# EAGLE design 1906152158-Dev Board (EAGLE 9.4.0)
DRAFTER: David Antaki; REV: 1; STATUS: ISSUED FOR REVIEW

## Sheet 1 of 3
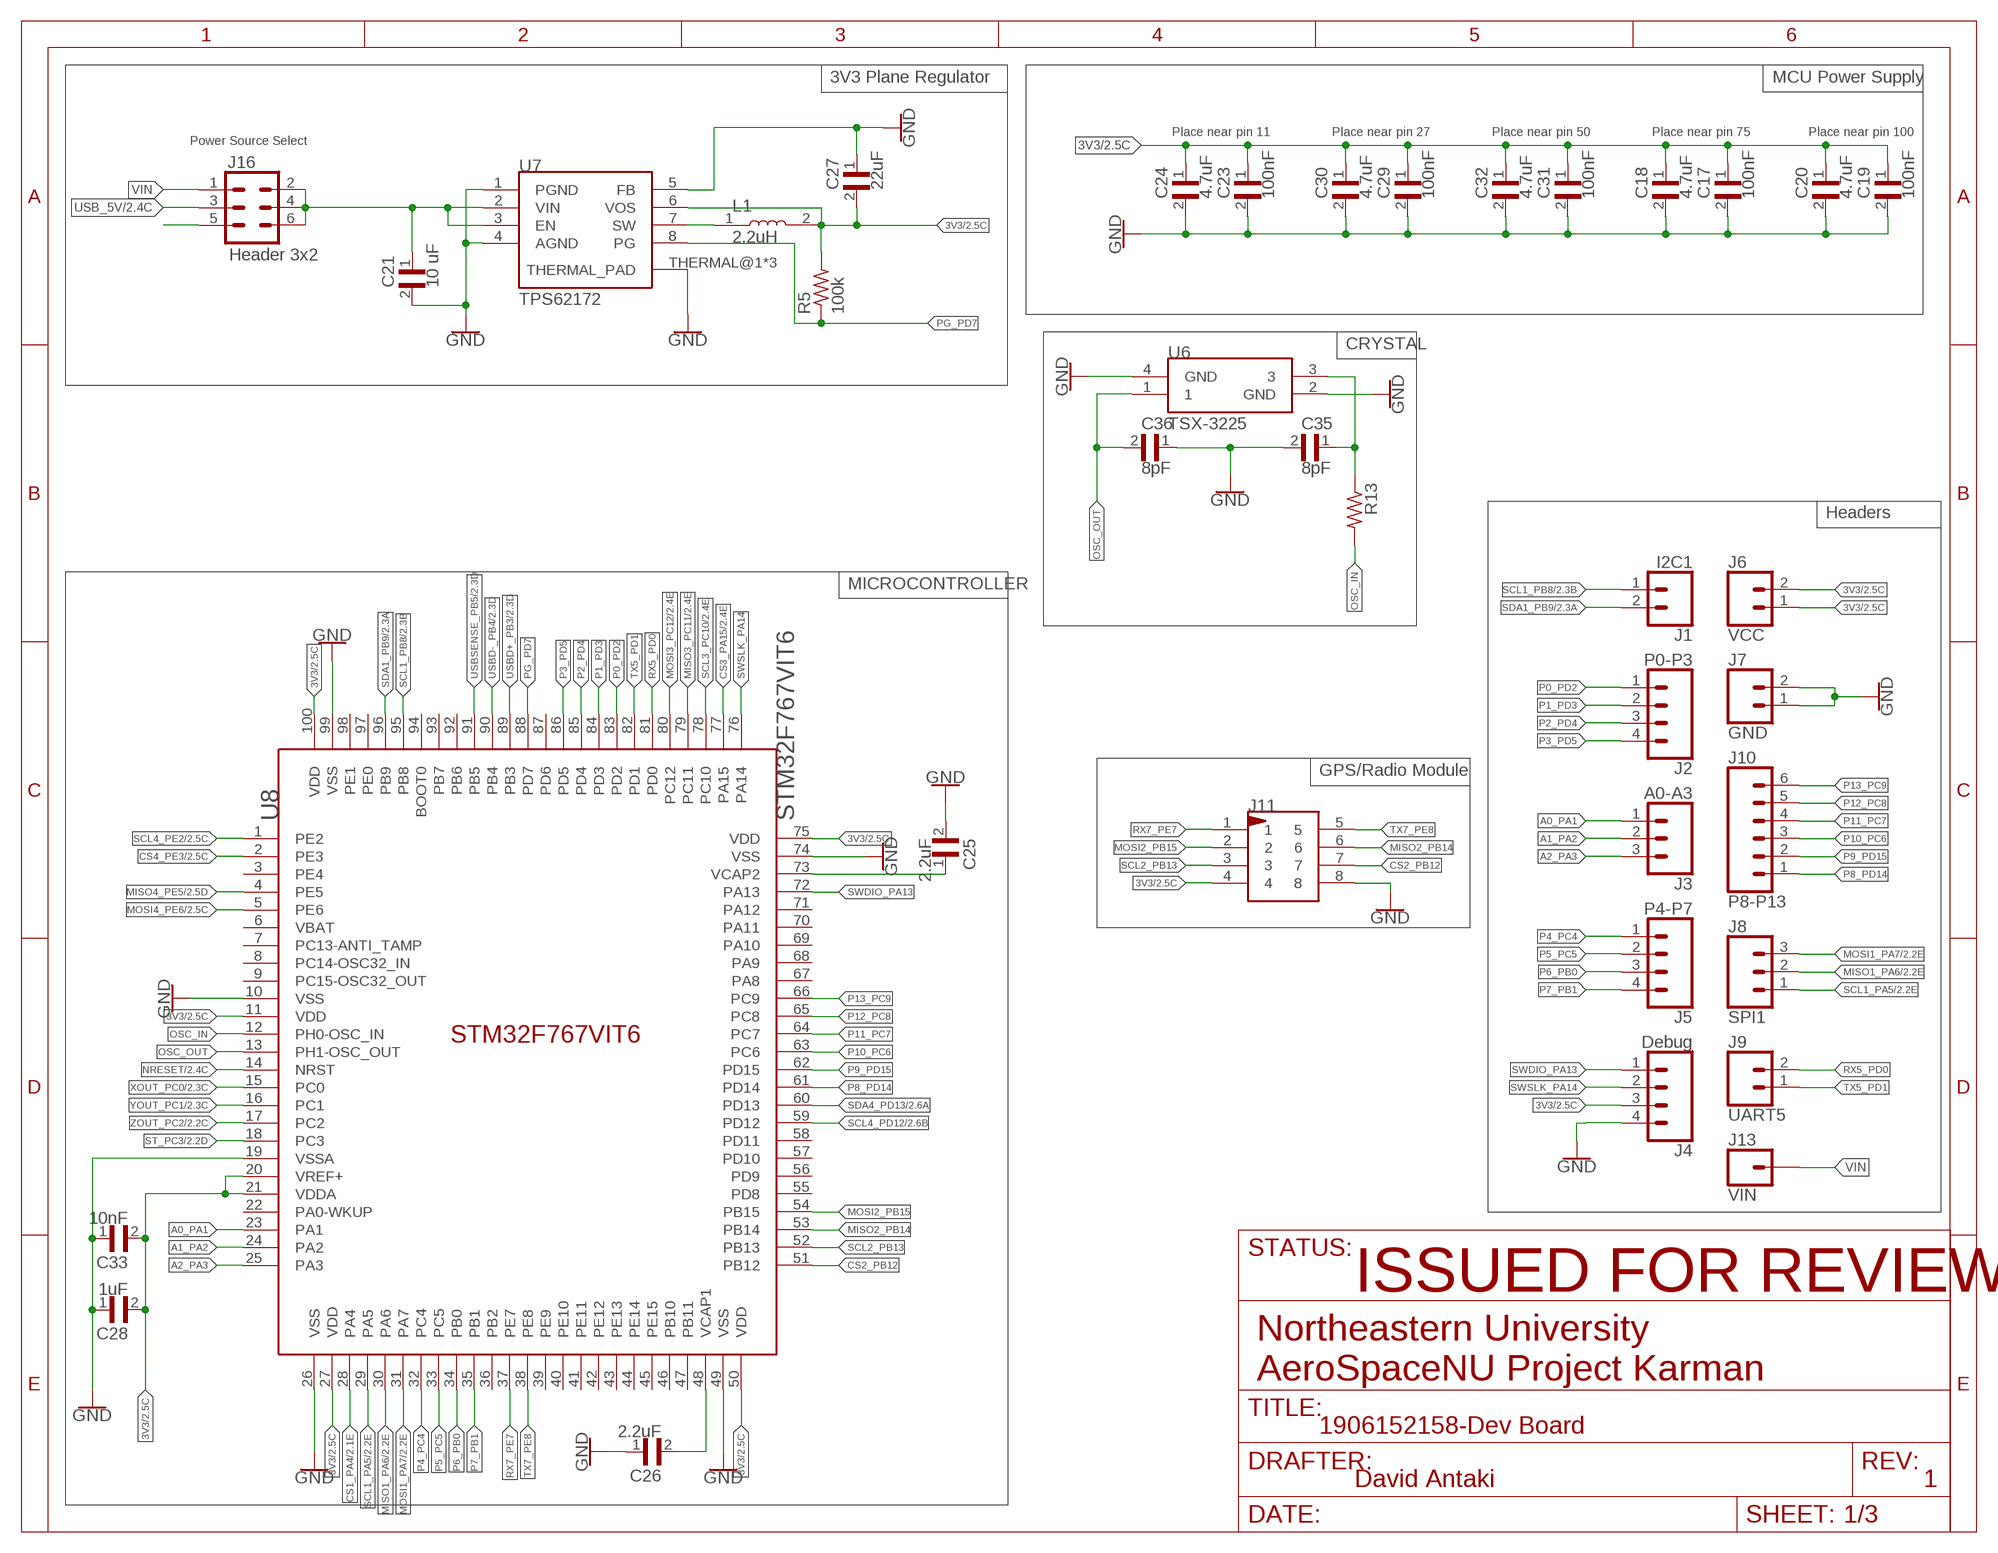
[diagram p0: schematic, sheet 1]

### Parts
C17  100nF  CGA3E2X7R1H104K080AD  [CAPC1608X95N]
C18  4.7uF  CGA3E2X7R1H104K080AD  [CAPC1608X95N]
C19  100nF  CGA3E2X7R1H104K080AD  [CAPC1608X95N]
C20  4.7uF  CGA3E2X7R1H104K080AD  [CAPC1608X95N]
C21  10 uF  CGA3E2X7R1H104K080AD  [CAPC1608X95N]
C23  100nF  CGA3E2X7R1H104K080AD  [CAPC1608X95N]
C24  4.7uF  CGA3E2X7R1H104K080AD  [CAPC1608X95N]
C25  2.2uF  CGA3E2X7R1H104K080AD  [CAPC1608X95N]
C26  2.2uF  CGA3E2X7R1H104K080AD  [CAPC1608X95N]
C27  22uF  CGA3E2X7R1H104K080AD  [CAPC1608X95N]
C28  1uF  CGA3E2X7R1H104K080AD  [CAPC1608X95N]
C29  100nF  CGA3E2X7R1H104K080AD  [CAPC1608X95N]
C30  4.7uF  CGA3E2X7R1H104K080AD  [CAPC1608X95N]
C31  100nF  CGA3E2X7R1H104K080AD  [CAPC1608X95N]
C32  4.7uF  CGA3E2X7R1H104K080AD  [CAPC1608X95N]
C33  10nF  CGA3E2X7R1H104K080AD  [CAPC1608X95N]
C35  8pF  CGA3E2X7R1H104K080AD  [CAPC1608X95N]
C36  8pF  CGA3E2X7R1H104K080AD  [CAPC1608X95N]
J1  I2C1  CONN_02  [1X02]
J2  P0-P3  CONN_04  [1X04]
J3  A0-A3  CONN_03  [1X03]
J4  Debug  CONN_04  [1X04]
J5  P4-P7  CONN_04  [1X04]
J6  VCC  CONN_02  [1X02]
J7  GND  CONN_02  [1X02]
J8  SPI1  CONN_03  [1X03]
J9  UART5  CONN_02  [1X02]
J10  P8-P13  CONN_06LOCK  [1X06_LOCK]
J11  087831-0819  [87831-0819]
J13  VIN  CONN_01  [1X01]
J16  Header 3x2  CONN_03X22X3_SILK_MALE_PTH  [2X3]
L1  2.2uH  MLF1608E100J  [INDC1608X95N]
R5  100k  CRGH0603F221K  [RESC1608X50N]
R13  CRGH0603F221K  [RESC1608X50N]
U6  TSX-3225  [TSX-3225]
U7  TPS62172  [TPS62172]
U8  STM32F767VIT6  [LQFP100_14X14]

### Nets
3V3: C17.1 C18.1 C19.1 C20.1 C23.1 C24.1 C27.2 C28.2 C29.1 C30.1 C31.1 C32.1 C33.2 J4.3 J6.1 J6.2 J11.4 L1.2 R5.2 U7.6(VOS) U8.11(VDD) U8.20(VREF+) U8.21(VDDA) U8.27(VDD) U8.50(VDD) U8.75(VDD) U8.100(VDD) ; also sheet 2
A0_PA1: J3.1 U8.23(PA1)
A1_PA2: J3.2 U8.24(PA2)
A2_PA3: J3.3 U8.25(PA3)
CS1_PA4: U8.28(PA4) ; also sheet 2
CS2_PB12: J11.7 U8.51(PB12)
CS3_PA15: U8.77(PA15) ; also sheet 2
CS4_PE3: U8.2(PE3) ; also sheet 2
GND: C17.2 C18.2 C19.2 C20.2 C21.2 C23.2 C24.2 C25.2 C26.1 C28.1 C29.2 C30.2 C31.2 C32.2 C33.1 C35.2 C36.1 J4.4 J7.1 J7.2 J11.8 U6.2(GND) U6.4(GND) U7.1(PGND) U7.4(AGND) U7.THERMAL@1(THERMAL_PAD) U7.THERMAL@2(THERMAL_PAD) U7.THERMAL@3(THERMAL_PAD) U8.10(VSS) U8.19(VSSA) U8.26(VSS) U8.49(VSS) U8.74(VSS) U8.99(VSS) ; also sheet 2
MISO1_PA6: J8.2 U8.30(PA6) ; also sheet 2
MISO2_PB14: J11.6 U8.53(PB14)
MISO3_PC11: U8.79(PC11) ; also sheet 2
MISO4_PE5: U8.4(PE5) ; also sheet 2
MOSI1_PA7: J8.3 U8.31(PA7) ; also sheet 2
MOSI2_PB15: J11.2 U8.54(PB15)
MOSI3_PC12: U8.80(PC12) ; also sheet 2
MOSI4_PE6: U8.5(PE6) ; also sheet 2
N$4: C25.1 U8.73(VCAP2)
N$7: C26.2 U8.48(VCAP1)
N$8: L1.1 U7.7(SW)
N$12: C27.1 U7.5(FB) ; supply symbol labelled GND
N$15: C35.1 R13.1 U6.3
N$17: J16.5
N$18: C21.1 J16.2 J16.4 J16.6 U7.2(VIN) U7.3(EN)
NRESET: U8.14(NRST) ; also sheet 2
OSC_IN: R13.2 U8.12(PH0-OSC_IN)
OSC_OUT: C36.2 U6.1 U8.13(PH1-OSC_OUT)
P0_PD2: J2.1 U8.83(PD2)
P1_PD3: J2.2 U8.84(PD3)
P2_PD4: J2.3 U8.85(PD4)
P3_PD5: J2.4 U8.86(PD5)
P4_PC4: J5.1 U8.32(PC4)
P5_PC5: J5.2 U8.33(PC5)
P6_PB0: J5.3 U8.34(PB0)
P7_PB1: J5.4 U8.35(PB1)
P8_PD14: J10.1 U8.61(PD14)
P9_PD15: J10.2 U8.62(PD15)
P10_PC6: J10.3 U8.63(PC6)
P11_PC7: J10.4 U8.64(PC7)
P12_PC8: J10.5 U8.65(PC8)
P13_PC9: J10.6 U8.66(PC9)
PG_PD7: R5.1 U7.8(PG) U8.88(PD7)
RX5_PD0: J9.2 U8.81(PD0)
RX7_PE7: J11.1 U8.37(PE7)
SCL1_PA5: J8.1 U8.29(PA5) ; also sheet 2
SCL1_PB8: J1.1 U8.95(PB8) ; also sheet 2
SCL2_PB13: J11.3 U8.52(PB13)
SCL3_PC10: U8.78(PC10) ; also sheet 2
SCL4_PD12: U8.59(PD12) ; also sheet 2
SCL4_PE2: U8.1(PE2) ; also sheet 2
SDA1_PB9: J1.2 U8.96(PB9) ; also sheet 2
SDA4_PD13: U8.60(PD13) ; also sheet 2
ST_PC3: U8.18(PC3) ; also sheet 2
SWDIO_PA13: J4.1 U8.72(PA13)
SWSLK_PA14: J4.2 U8.76(PA14)
TX5_PD1: J9.1 U8.82(PD1)
TX7_PE8: J11.5 U8.38(PE8)
USB_5V: J16.3 ; also sheet 2
USBD+_PB3: U8.89(PB3) ; also sheet 2
USBD-_PB4: U8.90(PB4) ; also sheet 2
USBSENSE_PB5: U8.91(PB5) ; also sheet 2
VIN: J13.1 J16.1
XOUT_PC0: U8.15(PC0) ; also sheet 2
YOUT_PC1: U8.16(PC1) ; also sheet 2
ZOUT_PC2: U8.17(PC2) ; also sheet 2
Unconnected: U8.3(PE4) U8.6(VBAT) U8.7(PC13-ANTI_TAMP) U8.8(PC14-OSC32_IN) U8.9(PC15-OSC32_OUT) U8.22(PA0-WKUP) U8.36(PB2) U8.39(PE9) U8.40(PE10) U8.41(PE11) U8.42(PE12) U8.43(PE13) U8.44(PE14) U8.45(PE15) U8.46(PB10) U8.47(PB11) U8.55(PD8) U8.56(PD9) U8.57(PD10) U8.58(PD11) U8.67(PA8) U8.68(PA9) U8.69(PA10) U8.70(PA11) U8.71(PA12) U8.87(PD6) U8.92(PB6) U8.93(PB7) U8.94(BOOT0) U8.97(PE0) U8.98(PE1)

### Notes on the sheet
- 3V3 Plane Regulator | MCU Power Supply
- Place near pin 11 | Place near pin 27 | Place near pin 50 | Place near pin 75 | Place near pin 100
- Power Source Select
- CRYSTAL
- Headers
- MICROCONTROLLER
- GPS/Radio Module

## Sheet 2 of 3
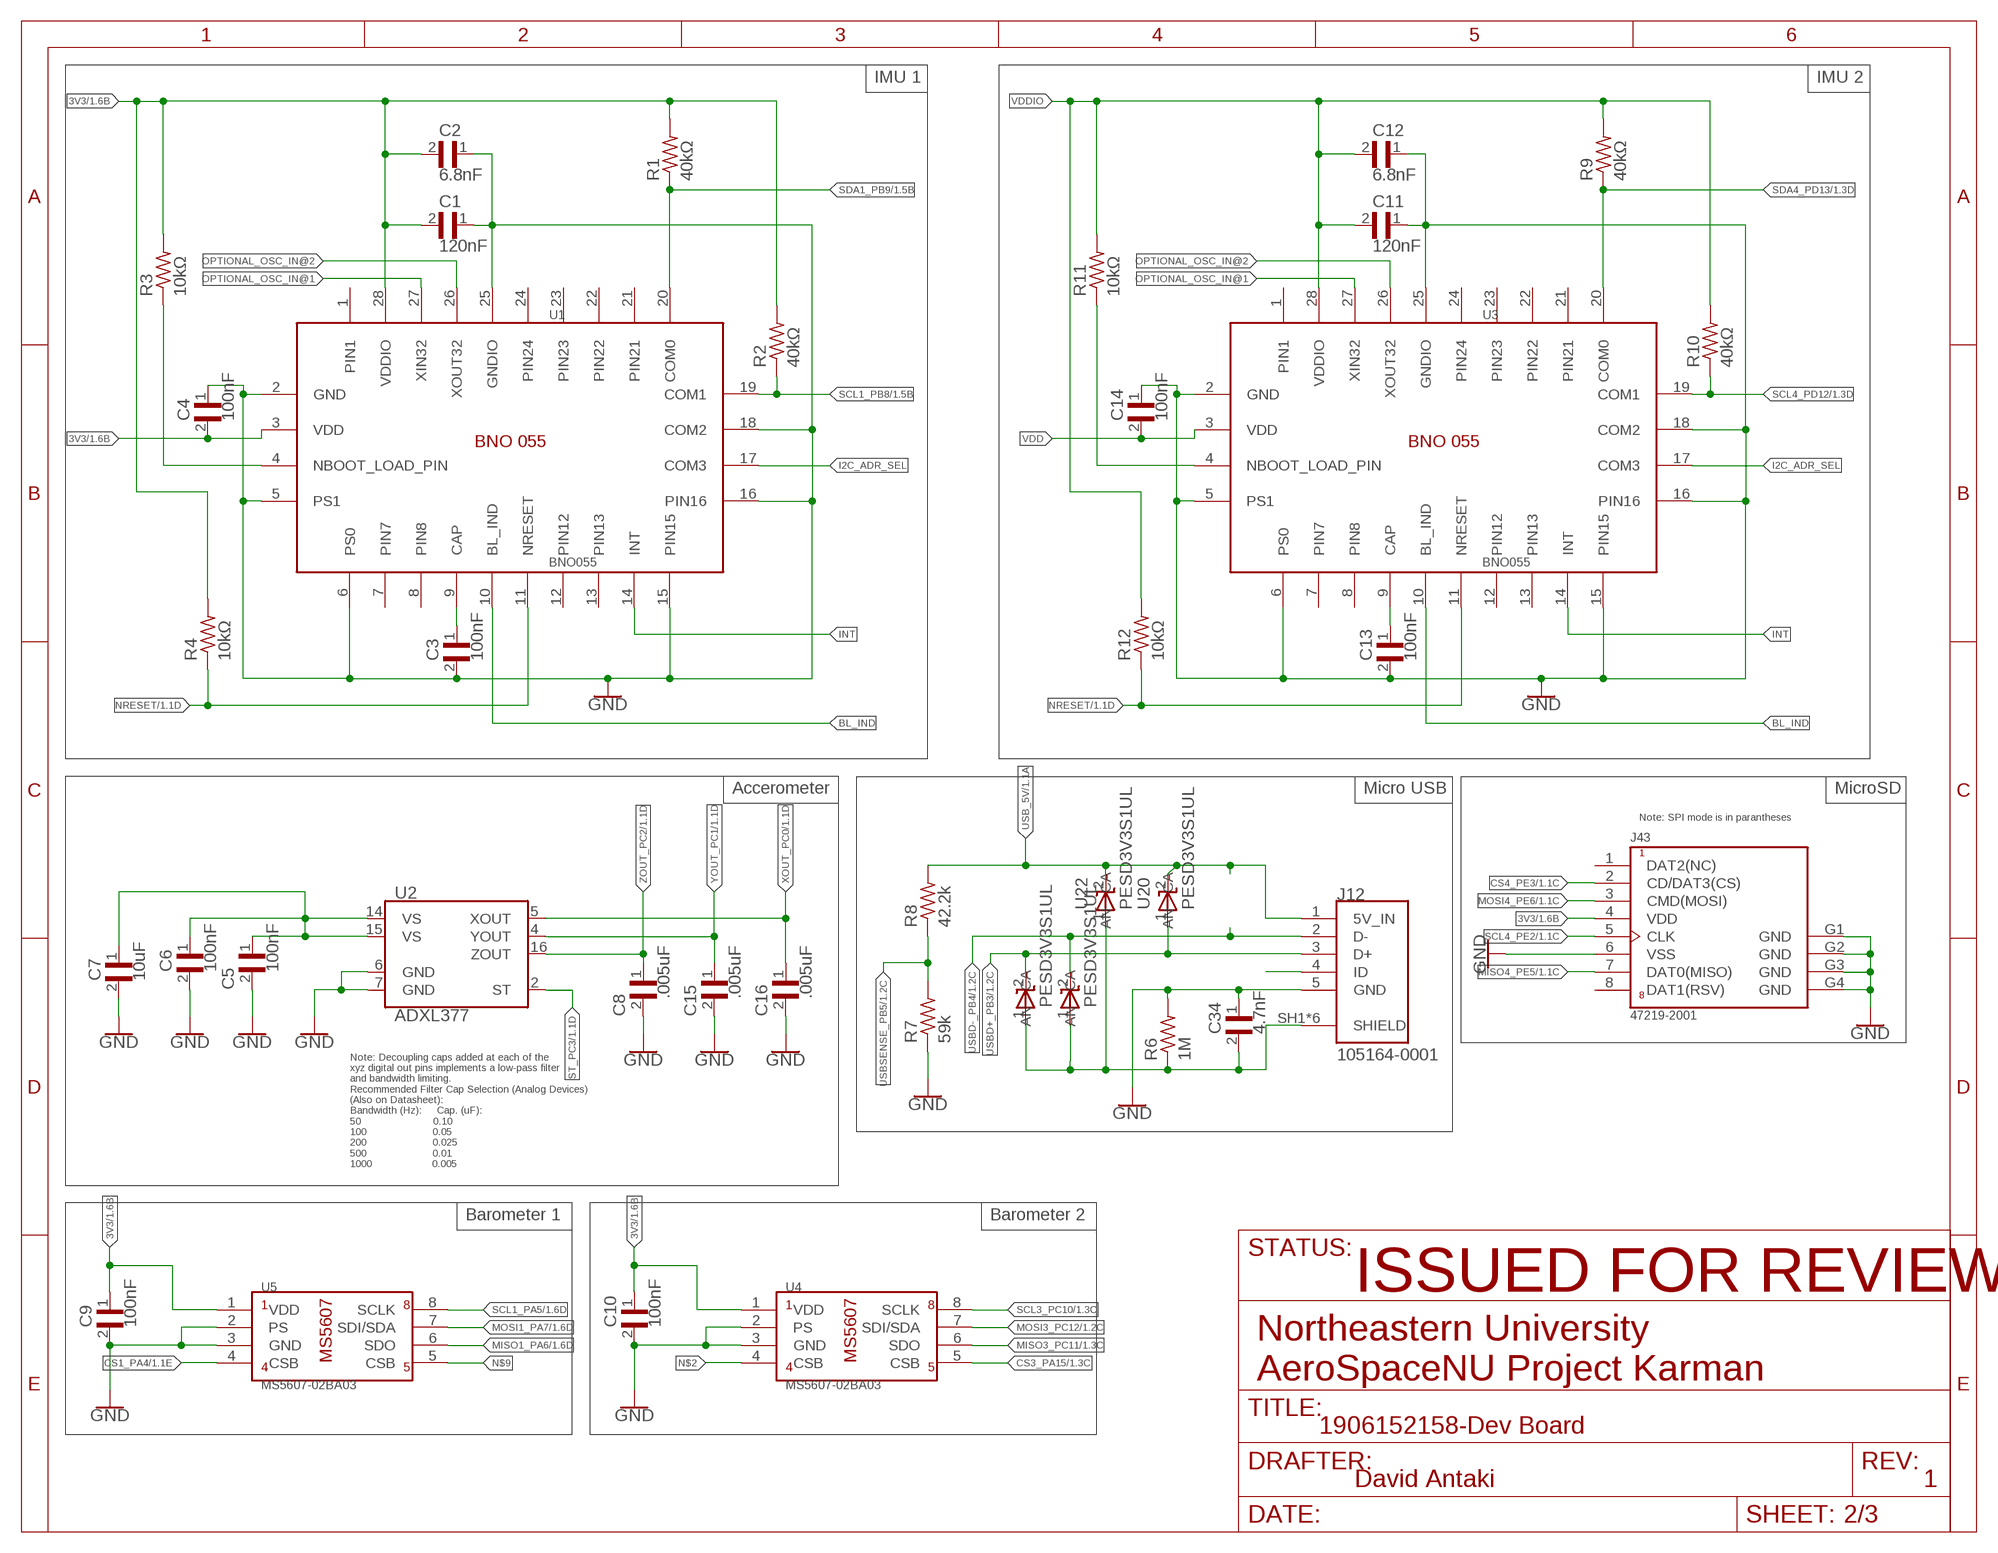
[diagram p1: schematic, sheet 2]

### Parts
C1  120nF  CGA3E2X7R1H104K080AD  [CAPC1608X95N]
C2  6.8nF  CGA3E2X7R1H104K080AD  [CAPC1608X95N]
C3  100nF  CGA3E2X7R1H104K080AD  [CAPC1608X95N]
C4  100nF  CGA3E2X7R1H104K080AD  [CAPC1608X95N]
C5  100nF  CGA3E2X7R1H104K080AD  [CAPC1608X95N]
C6  100nF  CGA3E2X7R1H104K080AD  [CAPC1608X95N]
C7  10uF  CGA3E2X7R1H104K080AD  [CAPC1608X95N]
C8  .005uF  CGA3E2X7R1H104K080AD  [CAPC1608X95N]
C9  100nF  CGA3E2X7R1H104K080AD  [CAPC1608X95N]
C10  100nF  CGA3E2X7R1H104K080AD  [CAPC1608X95N]
C11  120nF  CGA3E2X7R1H104K080AD  [CAPC1608X95N]
C12  6.8nF  CGA3E2X7R1H104K080AD  [CAPC1608X95N]
C13  100nF  CGA3E2X7R1H104K080AD  [CAPC1608X95N]
C14  100nF  CGA3E2X7R1H104K080AD  [CAPC1608X95N]
C15  .005uF  CGA3E2X7R1H104K080AD  [CAPC1608X95N]
C16  .005uF  CGA3E2X7R1H104K080AD  [CAPC1608X95N]
C34  4.7nF  CGA3E2X7R1H104K080AD  [CAPC1608X95N]
J12  105164-0001  [MOLEX_105164-0001]
J43  47219-2001  [MOLEX_47219-2001]
R1  40kΩ  CRGH0603F221K  [RESC1608X50N]
R2  40kΩ  CRGH0603F221K  [RESC1608X50N]
R3  10kΩ  CRGH0603F221K  [RESC1608X50N]
R4  10kΩ  CRGH0603F221K  [RESC1608X50N]
R6  1M  CRGH0603F221K  [RESC1608X50N]
R7  59k  CRGH0603F221K  [RESC1608X50N]
R8  42.2k  CRGH0603F221K  [RESC1608X50N]
R9  40kΩ  CRGH0603F221K  [RESC1608X50N]
R10  40kΩ  CRGH0603F221K  [RESC1608X50N]
R11  10kΩ  CRGH0603F221K  [RESC1608X50N]
R12  10kΩ  CRGH0603F221K  [RESC1608X50N]
U1  BNO055  [LGA28R50P4X10_380X520X100]
U2  ADXL377  [LFCSP-16-3X3]
U3  BNO055  [LGA28R50P4X10_380X520X100]
U4  MS5607-02BA03  [TE_MS860702BA01-50]
U5  MS5607-02BA03  [TE_MS860702BA01-50]
U20  PESD3V3S1UL  [SOD882]
U22  PESD3V3S1UL  [SOD882]
U23  PESD3V3S1UL  [SOD882]
U24  PESD3V3S1UL  [SOD882]

### Nets
3V3: C1.2 C2.2 C4.2 C9.1 C10.1 J43.4(VDD) R1.2 R2.2 R3.2 R4.2 U1.3(VDD) U1.28(VDDIO) U4.1(VDD) U5.1(VDD) ; also sheet 1
BL_IND: U1.10(BL_IND) U3.10(BL_IND)
CS1_PA4: U5.4(CSB) ; also sheet 1
CS3_PA15: U4.5(CSB) ; also sheet 1
CS4_PE3: J43.2(CD/DAT3(CS)) ; also sheet 1
GND: C1.1 C2.1 C3.2 C4.1 C5.2 C6.2 C7.2 C8.2 C9.2 C10.2 C11.1 C12.1 C13.2 C14.1 C15.2 C16.2 C34.1 J12.5(GND) J43.6(VSS) J43.G1(GND) J43.G2(GND) J43.G3(GND) J43.G4(GND) R6.2 R7.1 U1.2(GND) U1.5(PS1) U1.6(PS0) U1.15(PIN15) U1.16(PIN16) U1.18(COM2) U1.25(GNDIO) U2.6(GND) U2.7(GND) U3.2(GND) U3.5(PS1) U3.6(PS0) U3.15(PIN15) U3.16(PIN16) U3.18(COM2) U3.25(GNDIO) U4.2(PS) U4.3(GND) U5.2(PS) U5.3(GND) ; also sheet 1
I2C_ADR_SEL: U1.17(COM3) U3.17(COM3)
INT: U1.14(INT) U3.14(INT)
MISO1_PA6: U5.6(SDO) ; also sheet 1
MISO3_PC11: U4.6(SDO) ; also sheet 1
MISO4_PE5: J43.7(DAT0(MISO)) ; also sheet 1
MOSI1_PA7: U5.7(SDI/SDA) ; also sheet 1
MOSI3_PC12: U4.7(SDI/SDA) ; also sheet 1
MOSI4_PE6: J43.3(CMD(MOSI)) ; also sheet 1
N$1: C3.1 U1.9(CAP)
N$2: U4.4(CSB)
N$3: R3.1 U1.4(NBOOT_LOAD_PIN)
N$5: C13.1 U3.9(CAP)
N$6: R11.1 U3.4(NBOOT_LOAD_PIN)
N$9: U5.5(CSB)
N$11: C5.1 C6.1 C7.1 U2.14(VS) U2.15(VS)
N$13: J12.4(ID)
N$14: C34.2 J12.SH1(SHIELD) J12.SH2(SHIELD) J12.SH3(SHIELD) J12.SH4(SHIELD) J12.SH5(SHIELD) J12.SH6(SHIELD) R6.1 U22.1(CA) U23.1(CA) U24.1(CA)
NRESET: R4.1 R12.1 U1.11(NRESET) U3.11(NRESET) ; also sheet 1
OPTIONAL_OSC_IN@1: U1.27(XIN32) U3.27(XIN32)
OPTIONAL_OSC_IN@2: U1.26(XOUT32) U3.26(XOUT32)
SCL1_PA5: U5.8(SCLK) ; also sheet 1
SCL1_PB8: R2.1 U1.19(COM1) ; also sheet 1
SCL3_PC10: U4.8(SCLK) ; also sheet 1
SCL4_PD12: R10.1 U3.19(COM1) ; also sheet 1
SCL4_PE2: J43.5(CLK) ; also sheet 1
SDA1_PB9: R1.1 U1.20(COM0) ; also sheet 1
SDA4_PD13: R9.1 U3.20(COM0) ; also sheet 1
ST_PC3: U2.2(ST) ; also sheet 1
USB_5V: J12.1(5V_IN) R8.2 U20.2(AN) U22.2(AN) ; also sheet 1
USBD+_PB3: J12.3(D+) U20.1(CA) U24.2(AN) ; also sheet 1
USBD-_PB4: J12.2(D-) U23.2(AN) ; also sheet 1
USBSENSE_PB5: R7.2 R8.1 ; also sheet 1
VDD: C14.2 U3.3(VDD)
VDDIO: C11.2 C12.2 R9.2 R10.2 R11.2 R12.2 U3.28(VDDIO)
XOUT_PC0: C16.1 U2.5(XOUT) ; also sheet 1
YOUT_PC1: C15.1 U2.4(YOUT) ; also sheet 1
ZOUT_PC2: C8.1 U2.16(ZOUT) ; also sheet 1
Unconnected: J43.1(DAT2(NC)) J43.8(DAT1(RSV)) U1.1(PIN1) U1.12(PIN12) U1.13(PIN13) U3.1(PIN1) U3.12(PIN12) U3.13(PIN13)

### Notes on the sheet
- IMU 1 | IMU 2
- Accerometer | Micro USB | MicroSD
- Note: Decoupling caps added at each of the
  xyz digital out pins implements a low-pass filter
  and bandwidth limiting.
  Recommended Filter Cap Selection (Analog Devices)
  (Also on Datasheet):
  Bandwidth (Hz):     Cap. (uF):
  50                        0.10
  100                      0.05
  200                      0.025
  500                      0.01
  1000                    0.005
- Barometer 1 | Barometer 2

## Sheet 3 of 3
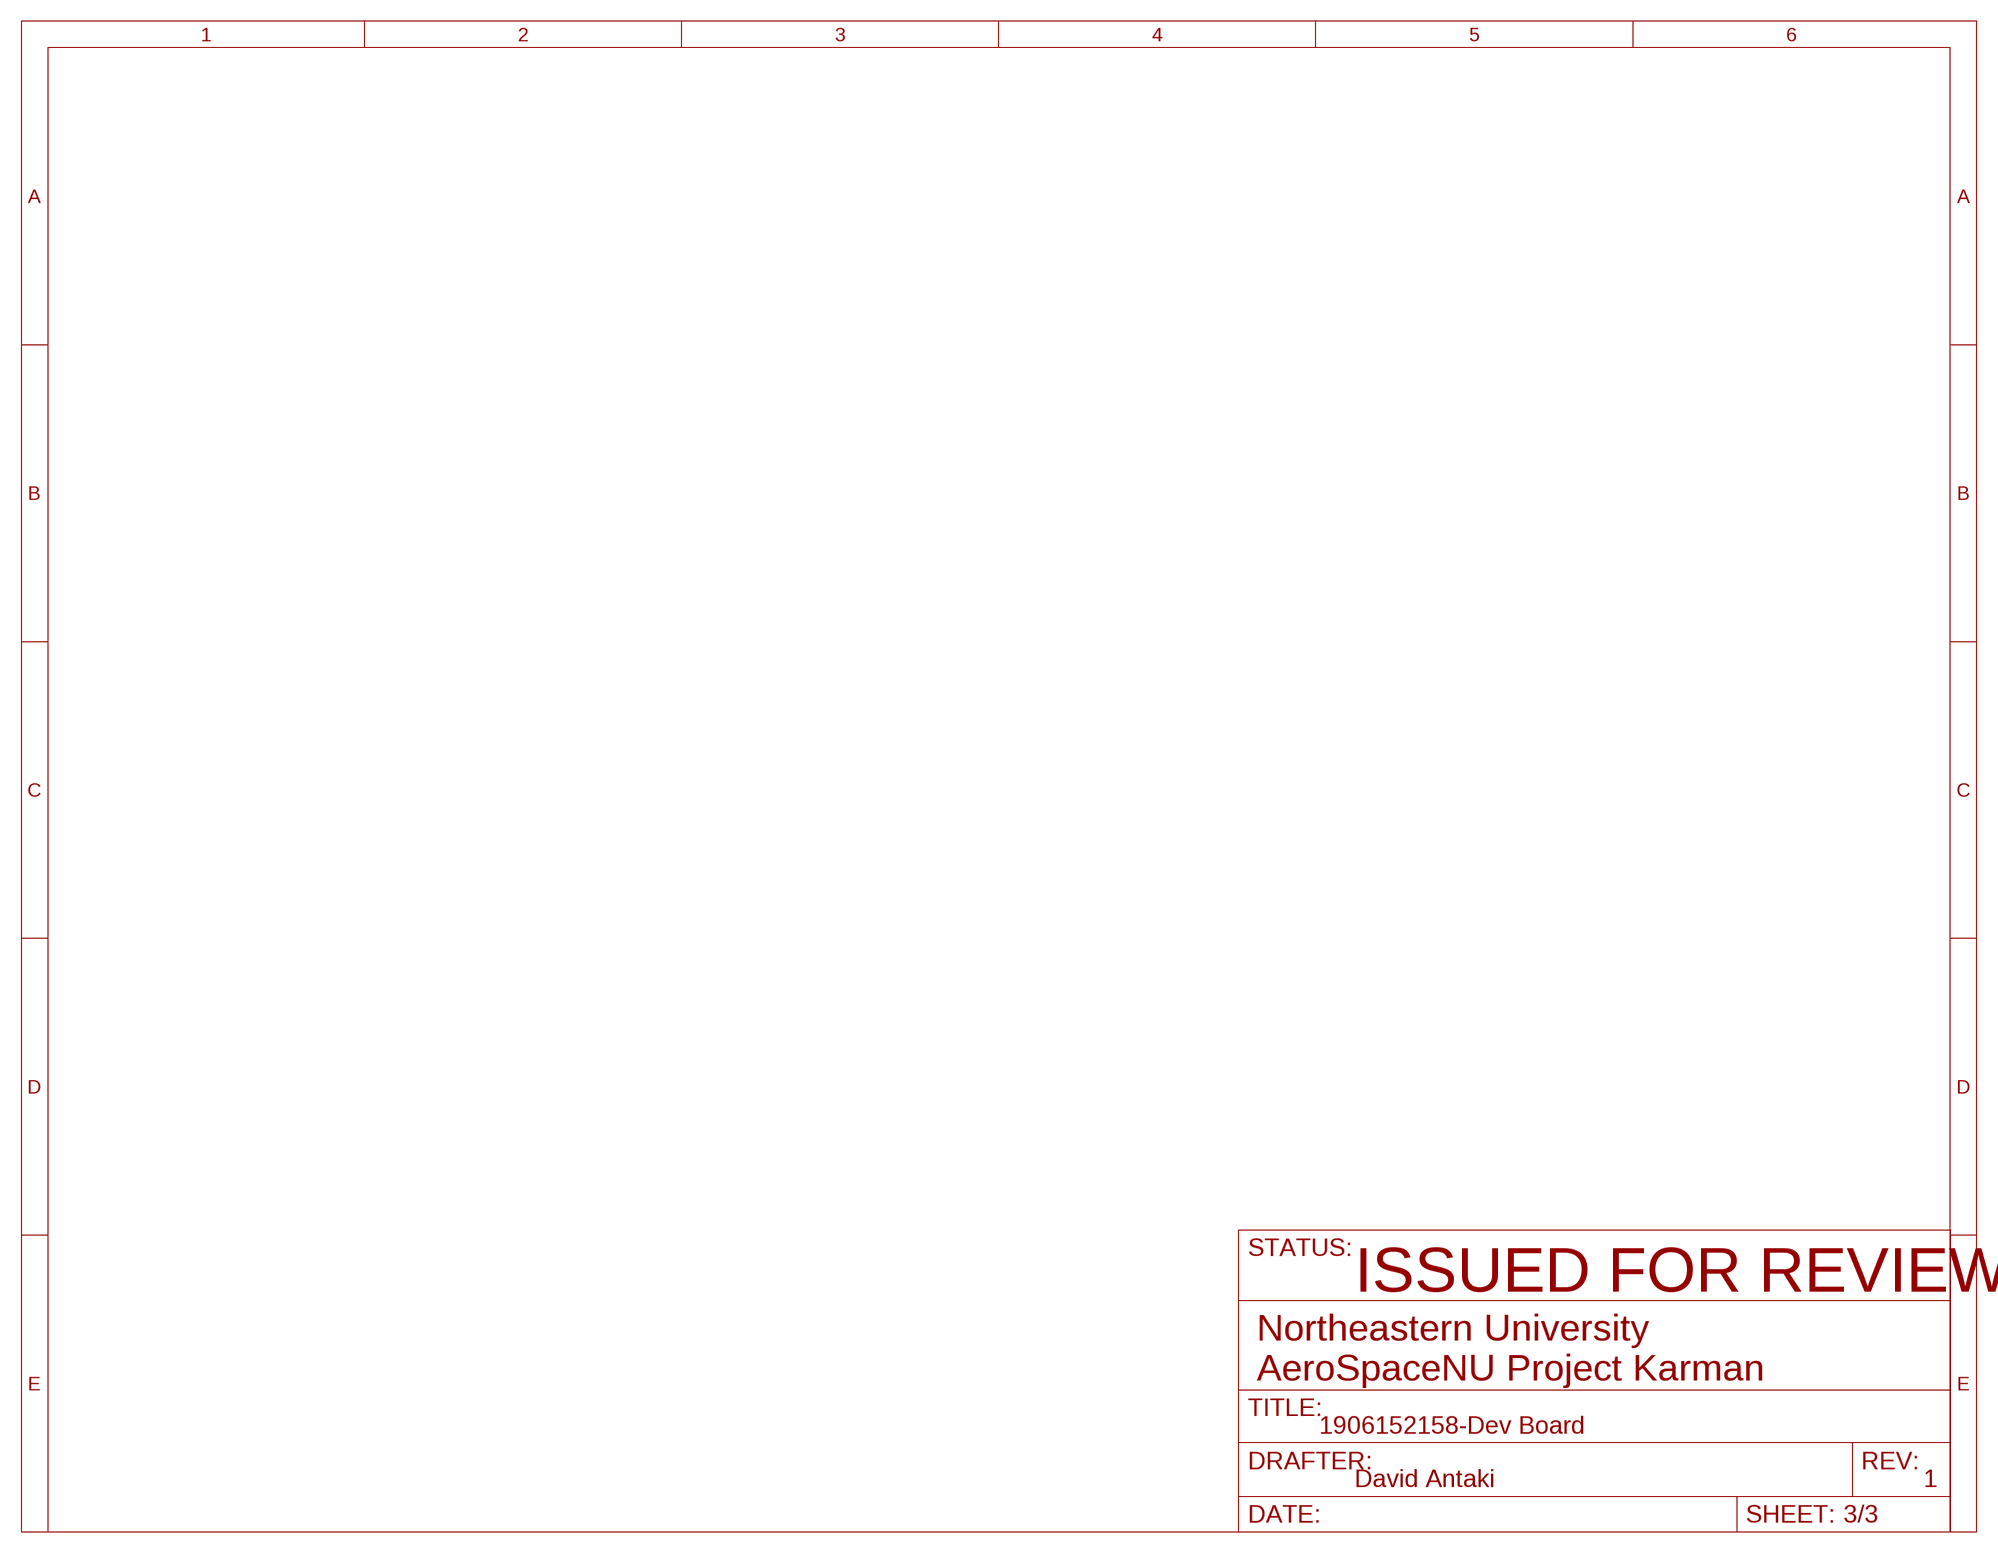
[diagram p2: schematic, sheet 3]

## Power pins joined to a net without a drawn wire
PIN7: U1.7(PIN7) U3.7(PIN7)
PIN8: U1.8(PIN8) U3.8(PIN8)
PIN21: U1.21(PIN21) U3.21(PIN21)
PIN22: U1.22(PIN22) U3.22(PIN22)
PIN23: U1.23(PIN23) U3.23(PIN23)
PIN24: U1.24(PIN24) U3.24(PIN24)

## Library data of the parts
C1-C21 C23-C36 = CGA3E2X7R1H104K080AD:CGA3E2X7R1H104K080AD: CGA Series 0603 0.1 uF 50 V ±10% X7R SMT Multilayer Ceramic Capacitor; AVAILABILITY: Unavailable; DESCRIPTION: CGA Series 0603 0.1 uF 50 V ±10% X7R SMT Multilayer Ceramic Capacitor; MF: TDK; MP: CGA3E2X7R1H104K080AD; PACKAGE: 0603 TDK; PRICE: None
J1 J6 J7 J9 = SparkFun-Connectors:CONN_02: Multi connection point. Often used as Generic Header-pin footprint for 0.1 inch spaced/style header connections On any of the 0.1 inch spaced packages, you can populate with these: Break Away Headers - Straight <https://www.sparkfun.com/products/116> (PRT-00116) Break Away Male Headers - Right Angle <https://www.sparkfun.com/products/553> (PRT-00553) Female Headers <https://www.sparkfun.com/products/115> (PRT-00115) Break Away Headers - Machine Pin <https://www.sparkfun.com/products/117> (PRT-00117) Break Away Female Headers - Swiss Machine Pin <https://www.sparkfun.com/products/743> (PRT-00743) For SCREWTERMINALS and SPRING TERMINALS visit here: Screw Terimnals on SparkFun.com <https://www.sparkfun.com/search/results?term=Screw+Terminals> (5mm/3.5mm/2.54mm spacing) This device is also useful as a general connection point to wire up your design to another part of your project. Our various solder wires solder well into these plated through hole pads. Hook-Up Wire - Assortment (Stranded, 22 AWG) <https://www.sparkfun.com/products/11375> (PRT-11375) Hook-Up Wire - Assortment (Solid Core, 22 AWG) <https://www.sparkfun.com/products/11367> (PRT-11367) View the entire wire category on our website here <https://www.sparkfun.com/categories/141> Special notes: Molex polarized connector foot print use with: PRT-08233 with associated crimp pins and housings. 2.54_SCREWTERM for use with PRT-10571. 3.5mm Screw Terminal footprints for PRT-08084 5mm Screw Terminal footprints for use with PRT-08432
J2 J4 J5 = SparkFun-Connectors:CONN_04: Multi connection point. Often used as Generic Header-pin footprint for 0.1 inch spaced/style header connections On any of the 0.1 inch spaced packages, you can populate with these: Break Away Headers - Straight <https://www.sparkfun.com/products/116> (PRT-00116) Break Away Male Headers - Right Angle <https://www.sparkfun.com/products/553> (PRT-00553) Female Headers <https://www.sparkfun.com/products/115> (PRT-00115) Break Away Headers - Machine Pin <https://www.sparkfun.com/products/117> (PRT-00117) Break Away Female Headers - Swiss Machine Pin <https://www.sparkfun.com/products/743> (PRT-00743) For SCREWTERMINALS and SPRING TERMINALS visit here: Screw Terimnals on SparkFun.com <https://www.sparkfun.com/search/results?term=Screw+Terminals> (5mm/3.5mm/2.54mm spacing) This device is also useful as a general connection point to wire up your design to another part of your project. Our various solder wires solder well into these plated through hole pads. Hook-Up Wire - Assortment (Stranded, 22 AWG) <https://www.sparkfun.com/products/11375> (PRT-11375) Hook-Up Wire - Assortment (Solid Core, 22 AWG) <https://www.sparkfun.com/products/11367> (PRT-11367) View the entire wire category on our website here <https://www.sparkfun.com/categories/141> Special notes: Molex polarized connector foot print use with SKU : PRT-08231 with associated crimp pins and housings. 1MM SMD Version SKU: PRT-10208; PROD_ID: CONN-09696
J3 J8 = SparkFun-Connectors:CONN_03: Multi connection point. Often used as Generic Header-pin footprint for 0.1 inch spaced/style header connections On any of the 0.1 inch spaced packages, you can populate with these: Break Away Headers - Straight <https://www.sparkfun.com/products/116> (PRT-00116) Break Away Male Headers - Right Angle <https://www.sparkfun.com/products/553> (PRT-00553) Female Headers <https://www.sparkfun.com/products/115> (PRT-00115) Break Away Headers - Machine Pin <https://www.sparkfun.com/products/117> (PRT-00117) Break Away Female Headers - Swiss Machine Pin <https://www.sparkfun.com/products/743> (PRT-00743) Stackable Header - 3 Pin (Female, 0.1") <https://www.sparkfun.com/products/13875> (PRT-13875) For SCREWTERMINALS and SPRING TERMINALS visit here: Screw Terimnals on SparkFun.com <https://www.sparkfun.com/search/results?term=Screw+Terminals> (5mm/3.5mm/2.54mm spacing) This device is also useful as a general connection point to wire up your design to another part of your project. Our various solder wires solder well into these plated through hole pads. Hook-Up Wire - Assortment (Stranded, 22 AWG) <https://www.sparkfun.com/products/11375> (PRT-11375) Hook-Up Wire - Assortment (Solid Core, 22 AWG) <https://www.sparkfun.com/products/11367> (PRT-11367) View the entire wire category on our website here <https://www.sparkfun.com/categories/141> Special notes: Molex polarized connector foot print use with SKU : PRT-08232 with associated crimp pins and housings.
J10 = SparkFun-Connectors:CONN_06: Multi connection point. Often used as Generic Header-pin footprint for 0.1 inch spaced/style header connections On any of the 0.1 inch spaced packages, you can populate with these: Break Away Headers - Straight <https://www.sparkfun.com/products/116> (PRT-00116) Break Away Male Headers - Right Angle <https://www.sparkfun.com/products/553> (PRT-00553) Female Headers <https://www.sparkfun.com/products/115> (PRT-00115) Break Away Headers - Machine Pin <https://www.sparkfun.com/products/117> (PRT-00117) Break Away Female Headers - Swiss Machine Pin <https://www.sparkfun.com/products/743> (PRT-00743) Arduino Stackable Header - 6 Pin <https://www.sparkfun.com/products/9280> (PRT-09280) For SCREWTERMINALS and SPRING TERMINALS visit here: Screw Terimnals on SparkFun.com <https://www.sparkfun.com/search/results?term=Screw+Terminals> (5mm/3.5mm/2.54mm spacing) This device is also useful as a general connection point to wire up your design to another part of your project. Our various solder wires solder well into these plated through hole pads. Hook-Up Wire - Assortment (Stranded, 22 AWG) <https://www.sparkfun.com/products/11375> (PRT-11375) Hook-Up Wire - Assortment (Solid Core, 22 AWG) <https://www.sparkfun.com/products/11367> (PRT-11367) View the entire wire category on our website here <https://www.sparkfun.com/categories/141>
J11 = Molex:087831-0819
J12 = 105164-0001:105164-0001: Micro-USB B Receptacle without Flange, Top Mount, Surface Mount, Lead-Free; AVAILABILITY: Unavailable; DESCRIPTION: Micro-USB B Receptacle without Flange, Top Mount, Surface Mount, Lead-Free; MF: Molex; MP: 105164-0001; PACKAGE: None; PRICE: None
J13 = SparkFun-Connectors:CONN_01: Single connection point. Often used as Generic Header-pin footprint for 0.1 inch spaced/style header connections On any of the 0.1 inch spaced packages, you can populate with these: Break Away Headers - Straight <https://www.sparkfun.com/products/116> (PRT-00116) Break Away Male Headers - Right Angle <https://www.sparkfun.com/products/553> (PRT-00553) Female Headers <https://www.sparkfun.com/products/115> (PRT-00115) Break Away Headers - Machine Pin <https://www.sparkfun.com/products/117> (PRT-00117) Break Away Female Headers - Swiss Machine Pin <https://www.sparkfun.com/products/743> (PRT-00743) This device is also useful as a general connection point to wire up your design to another part of your project. Our various solder wires solder well into these plated through hole pads. Hook-Up Wire - Assortment (Stranded, 22 AWG) <https://www.sparkfun.com/products/11375> (PRT-11375) Hook-Up Wire - Assortment (Solid Core, 22 AWG) <https://www.sparkfun.com/products/11367> (PRT-11367) View the entire wire category on our website here <https://www.sparkfun.com/categories/141> Special notes: SMTSO-256-ET is a "flush mount" nut for a 4-40 screw. We mostly use this on specialty testbeds; it is a nice way to connect hardware to your PCB at an adjustable hieght. Also note, the SNAP packages are for using a snappable style connector. We sell a baggie of snaps and they are also used on two LilyPad designs: Snap Assortment - 30 pack (male and female) <https://www.sparkfun.com/products/11347> (DEV-11347) LilyPad Arduino SimpleSnap <https://www.sparkfun.com/products/10941> (DEV-10941) LilyPad SimpleSnap Protoboard <https://www.sparkfun.com/products/10940> (DEV-10940)
J16 = SparkFun-Connectors:CONN_03X2: Multi connection point. Often used as Generic Header-pin footprint for 0.1 inch spaced/style header connections You can populate with any combo of single row headers, but if you'd like an exact match, check these: Header - 2x3 (Male, 0.1") <https://www.sparkfun.com/products/12807> (PRT-12807) Header - 2x3 (Female, 0.1") <https://www.sparkfun.com/products/13010> (PRT-13010) 2x3 Pin Shrouded Header <https://www.sparkfun.com/products/10877> (PRT-10877) On any of the 0.1 inch spaced packages, you can populate with these: Break Away Headers - Straight <https://www.sparkfun.com/products/116> (PRT-00116) Break Away Male Headers - Right Angle <https://www.sparkfun.com/products/553> (PRT-00553) Female Headers <https://www.sparkfun.com/products/115> (PRT-00115) Break Away Headers - Machine Pin <https://www.sparkfun.com/products/117> (PRT-00117) Break Away Female Headers - Swiss Machine Pin <https://www.sparkfun.com/products/743> (PRT-00743) Special note: the shrouded connector mates well with our 3x2 ribbon cables: Ribbon Crimp Connector - 6-pin (2x3, Female) <https://www.sparkfun.com/products/10651> (PRT-10651) Ribbon Cable - 6 wire (15ft) <https://www.sparkfun.com/products/10646> (PRT-10646); PROD_ID: CONN-09701
J43 = 47219-2001:47219-2001: 1.10mm Pitch microSD Card Connector, Hinge Type, Lead-Free http://www.snapeda.com/parts/47219-2001/Molex%20/%20Waldom/view-part/#; AVAILABILITY: Unavailable; DESCRIPTION: Conn Micro SD Card SKT 8 POS 1.1mm Solder RA SMD 0.5A/Contact Embossed T/R; MF: Molex; MP: 47219-2001; PACKAGE: None; PRICE: None
L1 = 0603_Inductor:MLF1608E100J: Ind Shielded Multi-Layer 10uH 5% 2MHz 30Q-Factor Ferrite 10mA 0603; AVAILABILITY: Unavailable; DESCRIPTION: Inductor RF Chip Shielded Multi-Layer 10uH 5% 2MHz 30Q-Factor Ferrite 10mA 1.7Ohm DCR 0603 T/R; MF: TDK; MP: MLF1608E100J; PACKAGE: 0603 TDK; PRICE: None
R1-R4 R9-R12 = CRGH0603F221K:CRGH0603F221K: Res Thick Film 0603 221K Ohm 1% 1/5W ±100ppm/°C Molded SMD SMD T/R; AVAILABILITY: Unavailable; COMMENT: 2-1879507-2; DESCRIPTION: Res Thick Film 0603 221K Ohm 1% 1/5W ±100ppm/°C Molded SMD SMD T/R; MF: TE Connectivity; MP: CRGH0603F221K; PACKAGE: 0603 TE Connectivity; PRICE: None; TE_PURCHASE_URL: https://www.te.com/usa-en/product-2-1879507-2.html?te_bu=Cor&te_type=disp&te_campaign=seda_glo_cor-seda-global-disp-prtnr-fy19-seda-model-bom-cta_sma-317_1&elqCampaignId=32493
R5-R8 R13 = 0603_Resistor:CRGH0603F221K: Res Thick Film 0603 221K Ohm 1% 1/5W ±100ppm/°C Molded SMD SMD T/R; AVAILABILITY: Unavailable; COMMENT: 2-1879507-2; DESCRIPTION: Res Thick Film 0603 221K Ohm 1% 1/5W ±100ppm/°C Molded SMD SMD T/R; MF: TE Connectivity; MP: CRGH0603F221K; PACKAGE: 0603 TE Connectivity; PRICE: None; TE_PURCHASE_URL: https://www.te.com/usa-en/product-2-1879507-2.html?te_bu=Cor&te_type=disp&te_campaign=seda_glo_cor-seda-global-disp-prtnr-fy19-seda-model-bom-cta_sma-317_1&elqCampaignId=32493
U1 U3 = BNO055:BNO055: BNO055 9-axis Absolute Orientation Sensor ( SiP ) w/Sensors and Sensor Fusion; AVAILABILITY: Unavailable; DESCRIPTION: BNO055 9-axis Absolute Orientation Sensor _ SiP _ w/Sensors and Sensor Fusion; MF: Bosch; MP: BNO055; PACKAGE: LGA-28 Bosch; PRICE: None
U2 = ADXL377:ADXL377: Analog Devices ADXL377 Low Power 3-Axis ±200 g Accelerometer with Analog Output The ADXL377 is a small, thin, low power, complete 3-axis accelerometer with signal conditioned voltage outputs. The ADXL377 measures acceleration resulting from motion, shock, or vibration with a typical full-scale range of ±200g. Datasheet <https://cdn.sparkfun.com/datasheets/Sensors/Accelerometers/ADXL377.pdf> SparkFun Products SparkFun Triple Axis Accelerometer Breakout - ADXL377 <https://www.sparkfun.com/products/12803> (SEN-12803); AVAILABILITY: Unavailable; DESCRIPTION: ADI Small, Low Power, 3-Axis +/-3g3x3x1.45mm; MF: Analog Devices; MP: ADXL377; PACKAGE: None; PRICE: None
U4 U5 = MS5607-02BA03:MS5607-02BA03
U6 = TSX-3225 16.0000MF09Z-AC0:TSX-3225
U7 = TPS62172:TPS62172
U8 = STM32F767VIT6:STM32F767VIT6
U20 U22-U24 = PESD3V3S1UL:PESD3V3S1UL: PESD3V3S1UL Zener Diode Made by David Antaki Digikey <https://www.digikey.com/product-detail/en/nexperia-usa-inc/PESD3V3S1UL315/1727-5353-1-ND/2676832> Datasheet <https://assets.nexperia.com/documents/data-sheet/PESDXS1UL_SER.pdf>

## Board
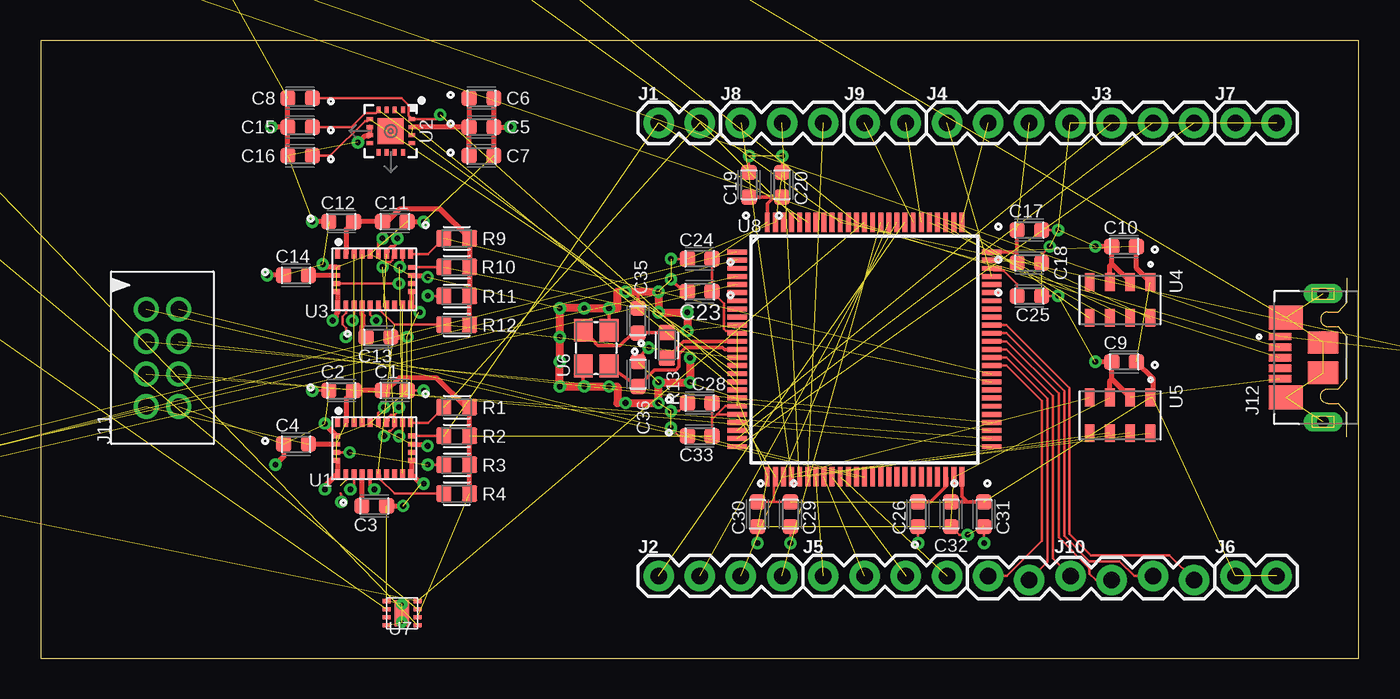
[diagram p3: board, top side]
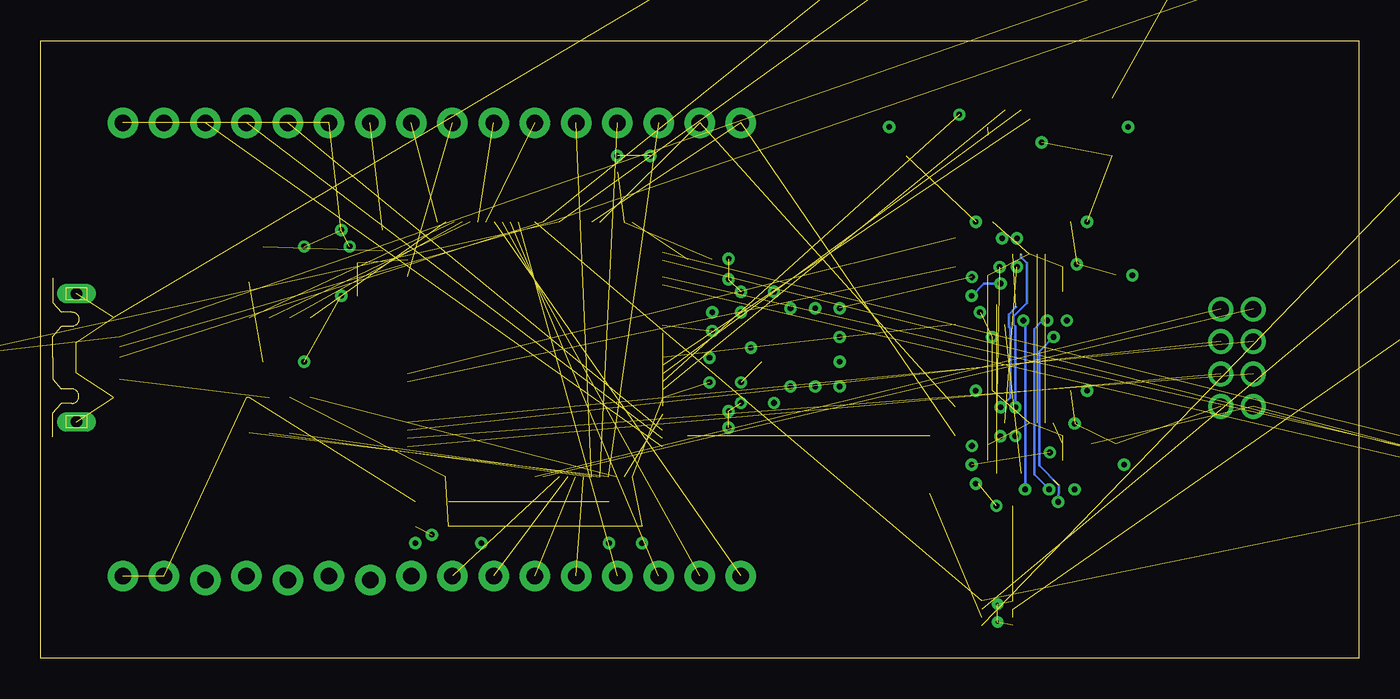
[diagram p4: board, bottom side, seen from below]

Size 81.28 x 38.1 mm. Coordinates in mm from the lower left corner, seen from the top.
Outline: 0,0 81.28,0 81.28,38.1 0,38.1 0,0
Copper layers (1*16): Top 0.035mm / dielectric 1.5mm / Bottom 0.035mm
Design rules "default": minimum track width 6mil, minimum drill 0.35mm, track to track 6mil, track to pad 6mil, pad to pad 6mil, via to via 6mil, smd to smd 6mil, copper to edge 40mil, drill to drill 6mil, minimum pad ring 10mil, minimum via ring 8mil, stop-mask expansion 4mil, vias tented up to drill 0mil, thermal gap 10mil

### Footprints (pad centres in the part's own frame; a part is rotated, then mirrored left to right if it is on the bottom)
CAPC1608X95N = smd 0.95 x 0.97: 1 -0.76,0; 2 0.76,0
1X02 = drill 1.016 pad 1.88: 1 0,0; 2 2.54,0
1X04 = drill 1.016 pad 1.88: 1 0,0; 2 2.54,0; 3 5.08,0; 4 7.62,0
1X03 = drill 1.016 pad 1.88: 1 0,0; 2 2.54,0; 3 5.08,0
1X06_LOCK = drill 1.016 pad 1.88: 1 0,0; 2 2.54,-0.254; 3 5.08,0; 4 7.62,-0.254; 5 10.16,0; 6 12.7,-0.254
87831-0819 = drill 1.016: 1 8.325,4.15; 2 6.325,4.15; 3 4.325,4.15; 4 2.325,4.15; 5 8.325,2.15; 6 6.325,2.15; 7 4.325,2.15; 8 2.325,2.15
MOLEX_105164-0001 = smd 0.45 x 1.38: 1 1.3,4.11; 2 0.65,4.11; 3 0,4.11; 4 -0.65,4.11; 5 -1.3,4.11 | drill 0.7 long: SH1 -3.95,1.45; SH6 3.95,1.45 | smd 1.475 x 2.1: SH2 -2.462,3.75; SH5 2.462,3.75 | smd 1.375 x 1.9: SH3 -0.938,1.45; SH4 0.938,1.45
1X01 = drill 1.016 pad 1.88: 1 0,0
2X3 = drill 1.016 pad 1.88: 1 0,0; 2 0,2.54; 3 2.54,0; 4 2.54,2.54; 5 5.08,0; 6 5.08,2.54
MOLEX_47219-2001 = smd 0.8 x 1.5: 1 3.2,-2.1; 2 2.1,-2.1; 3 1,-2.1; 4 -0.1,-2.1; 5 -1.2,-2.1; 6 -2.3,-2.1; 7 -3.4,-2.1; 8 -4.5,-2.1 | smd 1.5 x 2.05: G1 6.875,-4.7; G2 6.875,3.6; G3 -6.875,3.6; G4 -6.875,-4.7
INDC1608X95N = smd 0.9 x 0.97: 1 -0.785,0; 2 0.785,0
RESC1608X50N = smd 0.94 x 1.02: 1 -0.79,0; 2 0.79,0
LGA28R50P4X10_380X520X100 = smd 0.3 x 0.525: 1 -2.25,1.562; 6 -2.25,-1.562; 7 -1.75,-1.562; 8 -1.25,-1.562; 9 -0.75,-1.562; 10 -0.25,-1.562; 11 0.25,-1.562; 12 0.75,-1.562; 13 1.25,-1.562; 14 1.75,-1.562; 15 2.25,-1.562; 20 2.25,1.562; 21 1.75,1.562; 22 1.25,1.562; 23 0.75,1.562; 24 0.25,1.562; 25 -0.25,1.562; 26 -0.75,1.562; 27 -1.25,1.562; 28 -1.75,1.562 | smd 0.425 x 0.3: 2 -2.312,0.75; 3 -2.312,0.25; 4 -2.312,-0.25; 5 -2.312,-0.75; 16 2.312,-0.75; 17 2.312,-0.25; 18 2.312,0.25; 19 2.312,0.75
LFCSP-16-3X3 = smd 0.4 x 0.25: 1 -1.3,0.75; 2 -1.3,0.25; 3 -1.3,-0.25; 4 -1.3,-0.75; 9 1.3,-0.75; 10 1.3,-0.25; 11 1.3,0.25; 12 1.3,0.75 | smd 0.25 x 0.4: 5 -0.75,-1.3; 6 -0.25,-1.3; 7 0.25,-1.3; 8 0.75,-1.3; 13 0.75,1.3; 14 0.25,1.3; 15 -0.25,1.3; 16 -0.75,1.3 | smd 1.6 x 1.6: EXP 0,0
TE_MS860702BA01-50 = smd 1.1 x 0.6: 1 -1.1,1.875; 2 -1.1,0.625; 3 -1.1,-0.625; 4 -1.1,-1.875; 5 1.1,-1.875; 6 1.1,-0.625; 7 1.1,0.625; 8 1.1,1.875
TSX-3225 = smd 1.4 x 1.15: 1 0,0; 2 2.2,0; 3 2.2,1.6; 4 0,1.6
TPS62172 = smd 0.5 x 0.25: 1 -0.01,1.5; 2 -0.01,1; 3 -0.01,0.5; 4 -0.01,0; 5 1.9,0; 6 1.9,0.5; 7 1.9,1; 8 1.9,1.5 | smd 0.9 x 1.6: THERMAL@1 0.95,0.75 | drill 0.2 pad 0.254: THERMAL@2 0.95,1.3; THERMAL@3 0.95,0.2
LQFP100_14X14 = smd 1.2 x 0.3: 1 -7.85,6; 2 -7.85,5.5; 3 -7.85,5; 4 -7.85,4.5; 5 -7.85,4; 6 -7.85,3.5; 7 -7.85,3; 8 -7.85,2.5; 9 -7.85,2; 10 -7.85,1.5; 11 -7.85,1; 12 -7.85,0.5; 13 -7.85,0; 14 -7.85,-0.5; 15 -7.85,-1; 16 -7.85,-1.5; 17 -7.85,-2; 18 -7.85,-2.5; 19 -7.85,-3; 20 -7.85,-3.5; 21 -7.85,-4; 22 -7.85,-4.5; 23 -7.85,-5; 24 -7.85,-5.5; 25 -7.85,-6; 51 7.85,-6; 52 7.85,-5.5; 53 7.85,-5; 54 7.85,-4.5; 55 7.85,-4; 56 7.85,-3.5; 57 7.85,-3; 58 7.85,-2.5; 59 7.85,-2; 60 7.85,-1.5; 61 7.85,-1; 62 7.85,-0.5; 63 7.85,0; 64 7.85,0.5; 65 7.85,1; 66 7.85,1.5; 67 7.85,2; 68 7.85,2.5; 69 7.85,3; 70 7.85,3.5; 71 7.85,4; 72 7.85,4.5; 73 7.85,5; 74 7.85,5.5; 75 7.85,6 | smd 0.3 x 1.2: 26 -6,-7.85; 27 -5.5,-7.85; 28 -5,-7.85; 29 -4.5,-7.85; 30 -4,-7.85; 31 -3.5,-7.85; 32 -3,-7.85; 33 -2.5,-7.85; 34 -2,-7.85; 35 -1.5,-7.85; 36 -1,-7.85; 37 -0.5,-7.85; 38 0,-7.85; 39 0.5,-7.85; 40 1,-7.85; 41 1.5,-7.85; 42 2,-7.85; 43 2.5,-7.85; 44 3,-7.85; 45 3.5,-7.85; 46 4,-7.85; 47 4.5,-7.85; 48 5,-7.85; 49 5.5,-7.85; 50 6,-7.85; 76 6,7.85; 77 5.5,7.85; 78 5,7.85; 79 4.5,7.85; 80 4,7.85; 81 3.5,7.85; 82 3,7.85; 83 2.5,7.85; 84 2,7.85; 85 1.5,7.85; 86 1,7.85; 87 0.5,7.85; 88 0,7.85; 89 -0.5,7.85; 90 -1,7.85; 91 -1.5,7.85; 92 -2,7.85; 93 -2.5,7.85; 94 -3,7.85; 95 -3.5,7.85; 96 -4,7.85; 97 -4.5,7.85; 98 -5,7.85; 99 -5.5,7.85; 100 -6,7.85
SOD882 = smd 0.4 x 0.7: 1 -0.35,0; 2 0.35,0

### Placement (x,y rotation side)
C1  21.84,16.51 180 top
C2  18.54,16.51 0 top
C3  20.57,9.4 0 top
C4  15.75,13.21 0 top
C5  27.18,32.77 0 top
C6  27.18,34.54 0 top
C7  27.18,30.99 0 top
C8  16,34.54 180 top
C9  66.8,18.29 180 top
C10  66.8,25.4 180 top
C11  21.84,26.92 180 top
C12  18.54,26.92 0 top
C13  20.83,19.81 0 top
C14  15.75,23.62 0 top
C15  16,32.77 180 top
C16  16,30.99 180 top
C17  60.96,26.42 0 top
C18  60.96,24.38 0 top
C19  43.69,29.21 90 top
C20  45.72,29.21 90 top
C21  -48.26,52.07 0 top  (outside the outline)
C23  40.64,22.61 180 top
C24  40.64,24.64 180 top
C25  60.96,22.35 0 top
C26  54.1,8.89 90 top
C27  -29.21,57.15 0 top  (outside the outline)
C28  40.64,15.75 0 top
C29  46.23,8.89 270 top
C30  44.2,8.89 270 top
C31  58.17,8.89 270 top
C32  56.13,8.89 270 top
C33  40.64,13.72 0 top
C34  -21.59,57.15 0 top  (outside the outline)
C35  36.83,20.83 90 top
C36  36.83,17.53 270 top
J1  38.1,33.02 0 top
J2  38.1,5.08 0 top
J3  66.04,33.02 0 top
J4  55.88,33.02 0 top
J5  48.26,5.08 0 top
J6  73.66,5.08 0 top
J7  73.66,33.02 0 top
J8  43.18,33.02 0 top
J9  50.8,33.02 0 top
J10  58.42,5.08 0 top
J11  10.67,13.21 90 top
J12  80.52,18.54 90 top
J13  -73.41,-26.16 0 top  (outside the outline)
J16  -69.34,-25.65 0 top  (outside the outline)
J43  -55.88,2.29 0 top  (outside the outline)
L1  -40.64,57.15 0 top  (outside the outline)
R1  25.65,15.49 0 top
R2  25.65,13.72 0 top
R3  25.65,11.94 0 top
R4  25.65,10.16 0 top
R5  -11.94,10.92 0 top  (outside the outline)
R6  -12.7,67.31 0 top  (outside the outline)
R7  1.27,60.96 0 top  (outside the outline)
R8  89.15,18.29 0 top  (outside the outline)
R9  25.65,25.91 0 top
R10  25.65,24.13 0 top
R11  25.65,22.35 0 top
R12  25.65,20.57 0 top
R13  38.61,19.3 270 top
U1  20.57,12.95 0 top
U2  21.59,32.51 270 top
U3  20.57,23.37 0 top
U4  66.55,22.1 270 top
U5  66.55,14.99 270 top
U6  35.05,18.03 90 top
U7  21.34,2.03 0 top
U8  50.8,19.05 0 top
U20  -41.91,60.96 0 top  (outside the outline)
U22  -45.72,60.96 0 top  (outside the outline)
U23  -49.53,60.96 0 top  (outside the outline)
U24  1.27,66.04 0 top  (outside the outline)

### Tracks (layer width: path | path; a pad name or v marks a point on that pad's centre or on a via)
3V3  (19 unrouted)
  Top 0.152: C29.1 45.21,9.65 | 45.21,9.65 C30.1 | 45.21,9.65 45.21,11.11 U8.27 | C33.2 41.4,14.73 | 41.4,14.73 C28.2 | 41.4,14.73 41.72,15.05 | U8.21 41.72,15.05 | 41.72,15.05 42.22,15.55 U8.20 | C24.1 C23.1 42.12,21.89 42.12,20.3 42.26,20.17 42.83,20.17 U8.11 | C1.2 21.34,16.51 21.46,16.51 | U1.3
  Top 0.203: 44.8,27.34 U8.100 44.8,28.04 45.21,28.45 | C20.1 45.21,28.45 | 45.21,28.45 C19.1 | C17.1 60.2,25.15 | 60.2,25.15 C18.1 | 60.2,25.15 60.1,25.05 U8.75 | C31.1 57.15,9.65 | 57.15,9.65 C32.1 | 57.15,9.65 56.8,10 U8.50
  Top 0.305: C1.2 C2.2 18.82,16.03 U1.28 | R4.2 R3.2 R2.2 R1.2 26.22,15.49 24.41,17.3 22.13,17.3 21.34,16.51 | C4.2 U1.3 | 68.58,16.09 68.58,17.27 C9.1 | U4.1 67.56,24.06 C10.1
A0_PA1  (1 unrouted)
A1_PA2  (1 unrouted)
A2_PA3  (1 unrouted)
BL_IND  (via drill 0.35)
  Top 0.152: v20.69,20.83 20.32,21.19 U3.10
  Top 0.203: v20.58,10.41 20.32,10.67 U1.10
  Bottom 0.152: v20.69,20.83 20.58,20.72 v20.58,10.41
CS1_PA4  (1 unrouted)
CS2_PB12  (1 unrouted)
CS3_PA15  (1 unrouted)
CS4_PE3  (1 unrouted)
GND  (via drill 0.35)  (63 unrouted)
  Top 0.152: C28.1 39.37,15.24 v38.86,15.24 | C33.1 39.37,13.72 v38.86,14.22 | C29.2 v46.23,7.11 | C30.2 v44.2,7.11 | C26.1 v54.1,7.11 | C31.2 v58.17,7.11 | C17.2 v62.74,26.42 | C20.2 v45.72,30.99 | C19.2 v43.69,30.99 | C25.2 v62.74,22.35 | C32.2 56.64,7.62 v57.15,7.62 | C18.2 61.72,24.89 v62.23,25.4 | C24.2 v38.86,24.64 | C1.1 v23.62,16.51 | C2.1 v16.76,16.51 | U1.5 18.32,12.14
  Top 0.203: C35.2 36.83,22.61 | C36.1 36.83,18.5 v37.49,19.15 | U6.2 v35.05,21.59 | U6.4 33.45,16.94 33.27,16.76 | C23.2 39.62,22.61 v38.86,23.37
  Top 0.305: C13.2 v22.61,19.81 | C14.1 v13.97,23.62 | C12.1 v16.76,26.92 | C11.1 v23.62,26.92 | C4.1 14.99,12.45 v14.48,11.94 | C3.2 v22.35,9.4 | v18,20.83 18.23,21.05 18.23,21.24 18.32,21.33 U3.6 18.32,22.55 U3.5 | v23.37,21.34 23.29,21.34 U3.15 22.89,21.87 U3.16 | U3.18 23.76,23.62 v23.86,23.51 | U3.2 17.58,24.12 v17.4,24.3 | U1.16 22.89,11.45 U1.15 23.45,10.77 v23.62,10.77 | v17.53,10.41 17.53,10.59 U1.6 18.32,12.14 U1.5 | U1.2 17.53,14.44 v17.53,14.48 | U1.18 23.76,13.2 v23.86,13.1 | C6.2 C5.2 | C5.2 C7.2 | C5.2 v28.96,32.77 | U2.6 U2.7 20.22,32.19 19.96,32.19 19.59,31.82 v19.56,31.82 | C15.2 v14.22,32.77 | C16.2 C15.2 | C15.2 C8.2 | v65.02,18.29 C9.2 66.04,17.22 | U5.2 66.04,17.22 | U5.3 65.92,17.1 66.04,17.22 | U4.2 66.04,24.33 | 66.04,24.33 C10.2 v65.02,25.4 | U4.3 65.92,24.21 66.04,24.33
  Top 0.508: v40.04,18.53 v40.04,17.02 v38.1,17.02 v38.1,15.75 v36.07,15.75 35.56,15.75 35.56,16.76 v35.05,16.76 v33.53,16.76 33.27,16.76 v32,16.76 32,18.03 v32,18.29 v32,19.81 32,21.55 v32.01,21.59 v33.53,21.59 v35.05,21.59 35.56,21.59 35.56,22.61 v36.07,22.61 36.83,22.61 37.08,22.61 v38.1,22.61 v38.1,21.34 v39.88,21.34 v39.88,20.18
I2C_ADR_SEL  (1 unrouted)
INT  (1 unrouted)
MISO1_PA6  (2 unrouted)
MISO2_PB14  (1 unrouted)
MISO3_PC11  (1 unrouted)
MISO4_PE5  (1 unrouted)
MOSI1_PA7  (2 unrouted)
MOSI2_PB15  (1 unrouted)
MOSI3_PC12  (1 unrouted)
MOSI4_PE6  (1 unrouted)
N$1
  Top 0.152: C3.1 19.7,9.51
  Top 0.305: C3.1 U1.9
N$3  (via drill 0.35)  (1 unrouted)
  Top 0.152: U1.4 v19.05,12.7 | v23.88,11.94 R3.1
N$4
  Top 0.152: U8.73 58.77,23.93 59.34,23.93 60.2,23.07 C25.1
N$5
  Top 0.152: C13.1 19.82,20.06
  Top 0.305: C13.1 19.82,20.06 19.82,20.47 19.9,20.55 19.9,21.11 19.82,21.19 U3.9
N$6  (via drill 0.35)
  Top 0.152: U3.4 v22.09,23.12 v22.1,23.11 | 24.64,22.13 R11.1 v23.88,22.35
  Bottom 0.152: v22.1,23.11 23.11,23.11 v23.88,22.35
N$7
  Top 0.203: C26.2 54.86,9.65 55.88,10.67 55.88,11.12 U8.48
N$8  (1 unrouted)
N$11  (1 unrouted)
  Top 0.305: C5.1 26.17,33.02 | C5.1 U2.15 | C6.1 C5.1 | C7.1 C5.1
N$12  (1 unrouted)
N$14  (10 unrouted)
N$15
  Top 0.203: U6.3 34.22,19.46 34.22,19.43 34.37,19.28 35.73,19.28 36.52,20.07 C35.1 36.86,20.09 R13.1
N$18  (5 unrouted)
NRESET  (2 unrouted)
  Top 0.152: U3.11 20.95,21.68 20.95,21.45 21.82,20.57 R12.1 | U1.11 20.95,11.27 20.95,11.03 21.82,10.16 R4.1
OPTIONAL_OSC_IN@1  (1 unrouted)
OPTIONAL_OSC_IN@2  (1 unrouted)
OSC_IN
  Top 0.203: R13.2 39.64,19.55 U8.12
OSC_OUT
  Top 0.203: U6.1 C36.2 37.85,17.79 39.17,17.79 39.37,17.99 39.37,18.77 39.76,19.17 42.05,19.17 42.16,19.05 U8.13
P0_PD2  (1 unrouted)
P1_PD3  (1 unrouted)
P2_PD4  (1 unrouted)
P3_PD5  (1 unrouted)
P4_PC4  (1 unrouted)
P5_PC5  (1 unrouted)
P6_PB0  (1 unrouted)
P7_PB1  (1 unrouted)
P8_PD14
  Top 0.152: U8.61 59.56,18.05 61.72,15.88 61.72,7.24 59.56,5.08 J10.1
P9_PD15
  Top 0.152: U8.62 59.56,18.55 62.07,16.04 62.07,5.94 J10.2
P10_PC6
  Top 0.152: U8.63 59.56,19.05 62.42,16.19 62.42,6.16 J10.3
P11_PC7
  Top 0.152: U8.64 59.56,19.55 62.77,16.34 62.77,7.47 64.67,5.56 64.67,5.21 65.05,4.83 J10.4
P12_PC8
  Top 0.152: U8.65 59.56,20.05 63.11,16.49 63.11,7.55 64.67,5.99 66.52,5.99 67.44,5.08 J10.5
P13_PC9
  Top 0.152: U8.66 59.56,20.55 63.42,16.69 63.42,7.68 64.74,6.35 69.6,6.35 J10.6
PG_PD7  (2 unrouted)
PIN7  (via drill 0.35)  (1 unrouted)
  Top 0.152: 18.82,11.05 U1.7 18.82,11 | 18.49,10.16 18.54,10.11 v18.54,9.65 | U3.7 18.82,21.29 18.61,21.08 18.61,20.58 18.82,20.36 v18.82,19.81
  Bottom 0.152: v18.54,9.65 18.54,10.11 18.49,10.16 18.49,10.66 19.71,11.89 19.71,18.92 v18.82,19.81
PIN8  (via drill 0.35)
  Top 0.152: U1.8 19.32,10.64 v19.1,10.41 | U3.8 19.32,20.93 v19.22,20.83
  Bottom 0.152: v19.1,10.41 20.02,11.34 20.02,19.81 20.02,20.32 19.51,20.83 v19.22,20.83
PIN21  (via drill 0.35)  (1 unrouted)
  Top 0.152: U1.21 22.32,13.92 v22.11,13.71 | U3.21 22.32,24.31 v22.14,24.13
PIN22  (via drill 0.35)  (1 unrouted)
  Top 0.152: v21.19,13.72 21.49,14.03 21.57,14.03 21.82,14.28 U1.22 | v21.08,24.14 21.08,24.19 21.33,24.44 21.57,24.44 21.7,24.57 21.7,24.81 U3.22
PIN23  (via drill 0.35)  (1 unrouted)
  Top 0.152: v22.1,15.49 22.1,15.29 21.82,15.01 21.58,15.01 21.45,14.87 21.45,14.64 U1.23 | v21.99,25.91 21.99,25.6 21.82,25.42 21.58,25.42 21.45,25.29 21.45,25.05 U3.23
  Bottom 0.152: v22.1,15.49 21.49,16.1 21.49,20.34 21.6,20.45 21.6,21.21 21.15,21.66
PIN24  (via drill 0.35)  (1 unrouted)
  Top 0.152: U1.24 20.82,15.13 v21.19,15.49 | U3.24 20.82,25.65 v21.08,25.91
  Bottom 0.152: v21.19,15.49 21.19,20.47 21.29,20.58 21.29,21.08 20.48,21.9 20.48,24.39 20.83,24.74 20.83,24.89
RX5_PD0  (1 unrouted)
RX7_PE7  (1 unrouted)
SCL1_PA5  (2 unrouted)
SCL1_PB8  (2 unrouted)
  Top 0.152: R2.1 24.85,13.7 U1.19
SCL2_PB13  (1 unrouted)
SCL3_PC10  (1 unrouted)
SCL4_PD12  (1 unrouted)
  Top 0.152: R10.1 24.85,24.12 U3.19
SCL4_PE2  (1 unrouted)
SDA1_PB9  (2 unrouted)
  Top 0.152: R1.1 23.89,14.52 U1.20
SDA4_PD13  (1 unrouted)
  Top 0.152: R9.1 23.89,24.93 U3.20
ST_PC3  (1 unrouted)
SWDIO_PA13  (1 unrouted)
SWSLK_PA14  (1 unrouted)
TX5_PD1  (1 unrouted)
TX7_PE8  (1 unrouted)
USB_5V  (4 unrouted)
USBD+_PB3  (3 unrouted)
USBD-_PB4  (2 unrouted)
USBSENSE_PB5  (2 unrouted)
VDD
  Top 0.152: U3.3
  Top 0.305: C14.2 U3.3
VDDIO
  Top 0.152: C11.2 | R9.2 26.11,25.91
  Top 0.305: C11.2 C12.2 18.82,26.45 U3.28 | R12.2 26.44,21.34 R11.2 R10.2 R9.2 24.64,27.71 22.14,27.71 21.35,26.92 C11.2
VIN  (1 unrouted)
XOUT_PC0  (1 unrouted)
  Top 0.152: U2.5 20.14,33.12 20,33.12 17.87,30.99 C16.1
YOUT_PC1  (1 unrouted)
  Top 0.152: U2.4 20.64,33.62 20,33.62 19.15,32.77 C15.1
ZOUT_PC2  (via drill 0.35)  (1 unrouted)
  Top 0.152: v24.64,33.53 24.37,33.26 U2.16 22.69,33.46 22.69,34.11 22.26,34.54 C8.1

### Text on the board
tPlace: Via drill: 0.3mm / Via Hole: Auto